# Altium schematic sheet Power.SchDoc
size A4; SheetNumber: 2; SheetTotal: 2
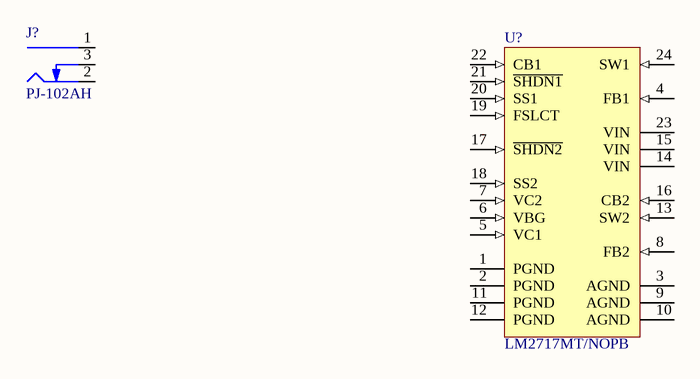
[diagram p0: Power.SchDoc]

## Parts
J?  PJ-102AH  [CUI PJ-102AH]
U?  LM2717MT/NOPB  [PW0024A_L]

## Nets

Not connected (* = marked no-connect by the designer): J? 1(Centre) 2(Outer) 3(SW); U? 1(PGND) 2(PGND) 3(AGND) 4(FB1) 5(VC1) 6(VBG) 7(VC2) 8(FB2) 9(AGND) 10(AGND) 11(PGND) 12(PGND) 13(SW2) 14(VIN) 15(VIN) 16(CB2) 17(~{SHDN2}) 18(SS2) 19(FSLCT) 20(SS1) 21(~{SHDN1}) 22(CB1) 23(VIN) 24(SW1)

## Library data of the parts
J? = PJ-102AH: CONN PWR JACK 2X5.5MM SOLDER; Manufacturer: CUI Devices; Actual Diameter: 0.079" (2.00mm ID), 0.256" (6.50mm OD); Current Rating (Amps): 5A; Gender: Male; Industry Recognized Mating Diameter: 2.00mm ID (0.079"), 5.50mm OD (0.217"); Internal Switch(s): Single Switch, Normally Closed; Material Flammability Rating: UL94 V-0; Mating Length/Depth: 0.354" (9.00mm); Number of Positions/Contacts: 2 Conductors, 3 Contacts; Shielding: Unshielded; Voltage - Rated: 24VDC; Part Number: PJ-102AH; ComponentLink1Description: Datasheet; ComponentLink1URL: https://www.cuidevices.com/product/resource/digikeypdf/pj-102ah.pdf; ComponentLink2Description: DigiKey Link; ComponentLink2URL: //digikey.com/product-detail/en/cui-devices/PJ-102AH/CP-102AH-ND/408448; Connector Type: Jack; LastUpdated: 16/12/2019 19:01:27; Lifecycle Status: 0; Minimum Order: 1; Mounting Type: Through Hole, Right Angle; Packaging: Tray; Part Status: Active; Price: 0.76; Series: -; Supplier 1: DigiKey; Supplier Part Number 1: CP-102AH-ND; Termination: Solder
U? = CMP-0069-01764-3: Dual Step-Down DC/DC Converter, 24-pin TSSOP, Pb-Free; Manufacturer: Texas Instruments; CompType: Switcher; PowerWise: N; PackageTopMarking: NSUZXYTTE#*LM2717MT; ComponentLink1URL: http://www.ti.com/general/docs/lit/getliterature.tsp?genericPartNumber=LM2717&fileType=pdf; RoHS: Y; ComponentLink1Description: Datasheet URL; PackageDescription: Molded TSSOP, Jedec, 7.8 x 4.4 x 0.9mm Body, 24 Lead, 0.65mm Pitch; Code_JEDEC: MO-153-AD; PackageReference: PW0024A; PinCount: 24